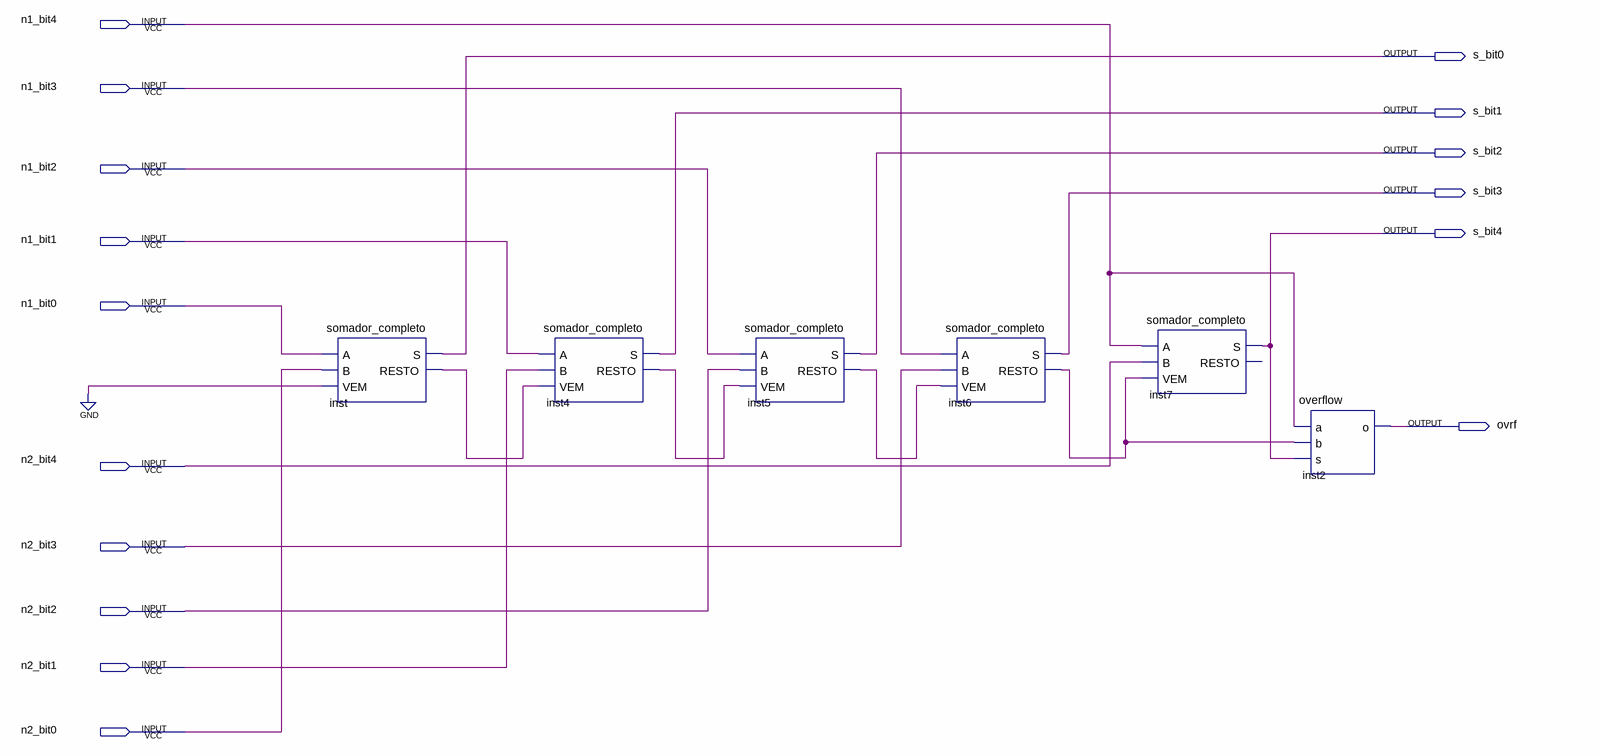
[diagram p0: schematic sheet]
// Quartus schematic somador.bdf as structural Verilog: 6 symbols, 16 pins
module somador (
  input  n1_bit4,
  input  n1_bit3,
  input  n1_bit2,
  input  n1_bit1,
  input  n1_bit0,
  input  n2_bit4,
  input  n2_bit3,
  input  n2_bit2,
  input  n2_bit1,
  input  n2_bit0,
  output s_bit0,
  output s_bit1,
  output s_bit2,
  output s_bit3,
  output s_bit4,
  output ovrf
);

  wire inst4_resto, inst5_resto, inst6_resto, inst_resto;

  somador_completo inst (.A(n1_bit0), .B(n2_bit0), .VEM(1'b0), .S(s_bit0), .RESTO(inst_resto));
  somador_completo inst4 (.A(n1_bit1), .B(n2_bit1), .VEM(inst_resto), .S(s_bit1), .RESTO(inst4_resto));
  somador_completo inst5 (.A(n1_bit2), .B(n2_bit2), .VEM(inst4_resto), .S(s_bit2), .RESTO(inst5_resto));
  somador_completo inst6 (.A(n1_bit3), .B(n2_bit3), .VEM(inst5_resto), .S(s_bit3), .RESTO(inst6_resto));
  somador_completo inst7 (.A(n1_bit4), .B(n2_bit4), .VEM(inst6_resto), .S(s_bit4));  // open: RESTO
  overflow inst2 (.a(n1_bit4), .b(inst6_resto), .s(s_bit4), .o(ovrf));
endmodule
